# EAGLE design SparkFun Refrigerator Gas Sensor (ZMOD4450) (EAGLE 9.6.0)
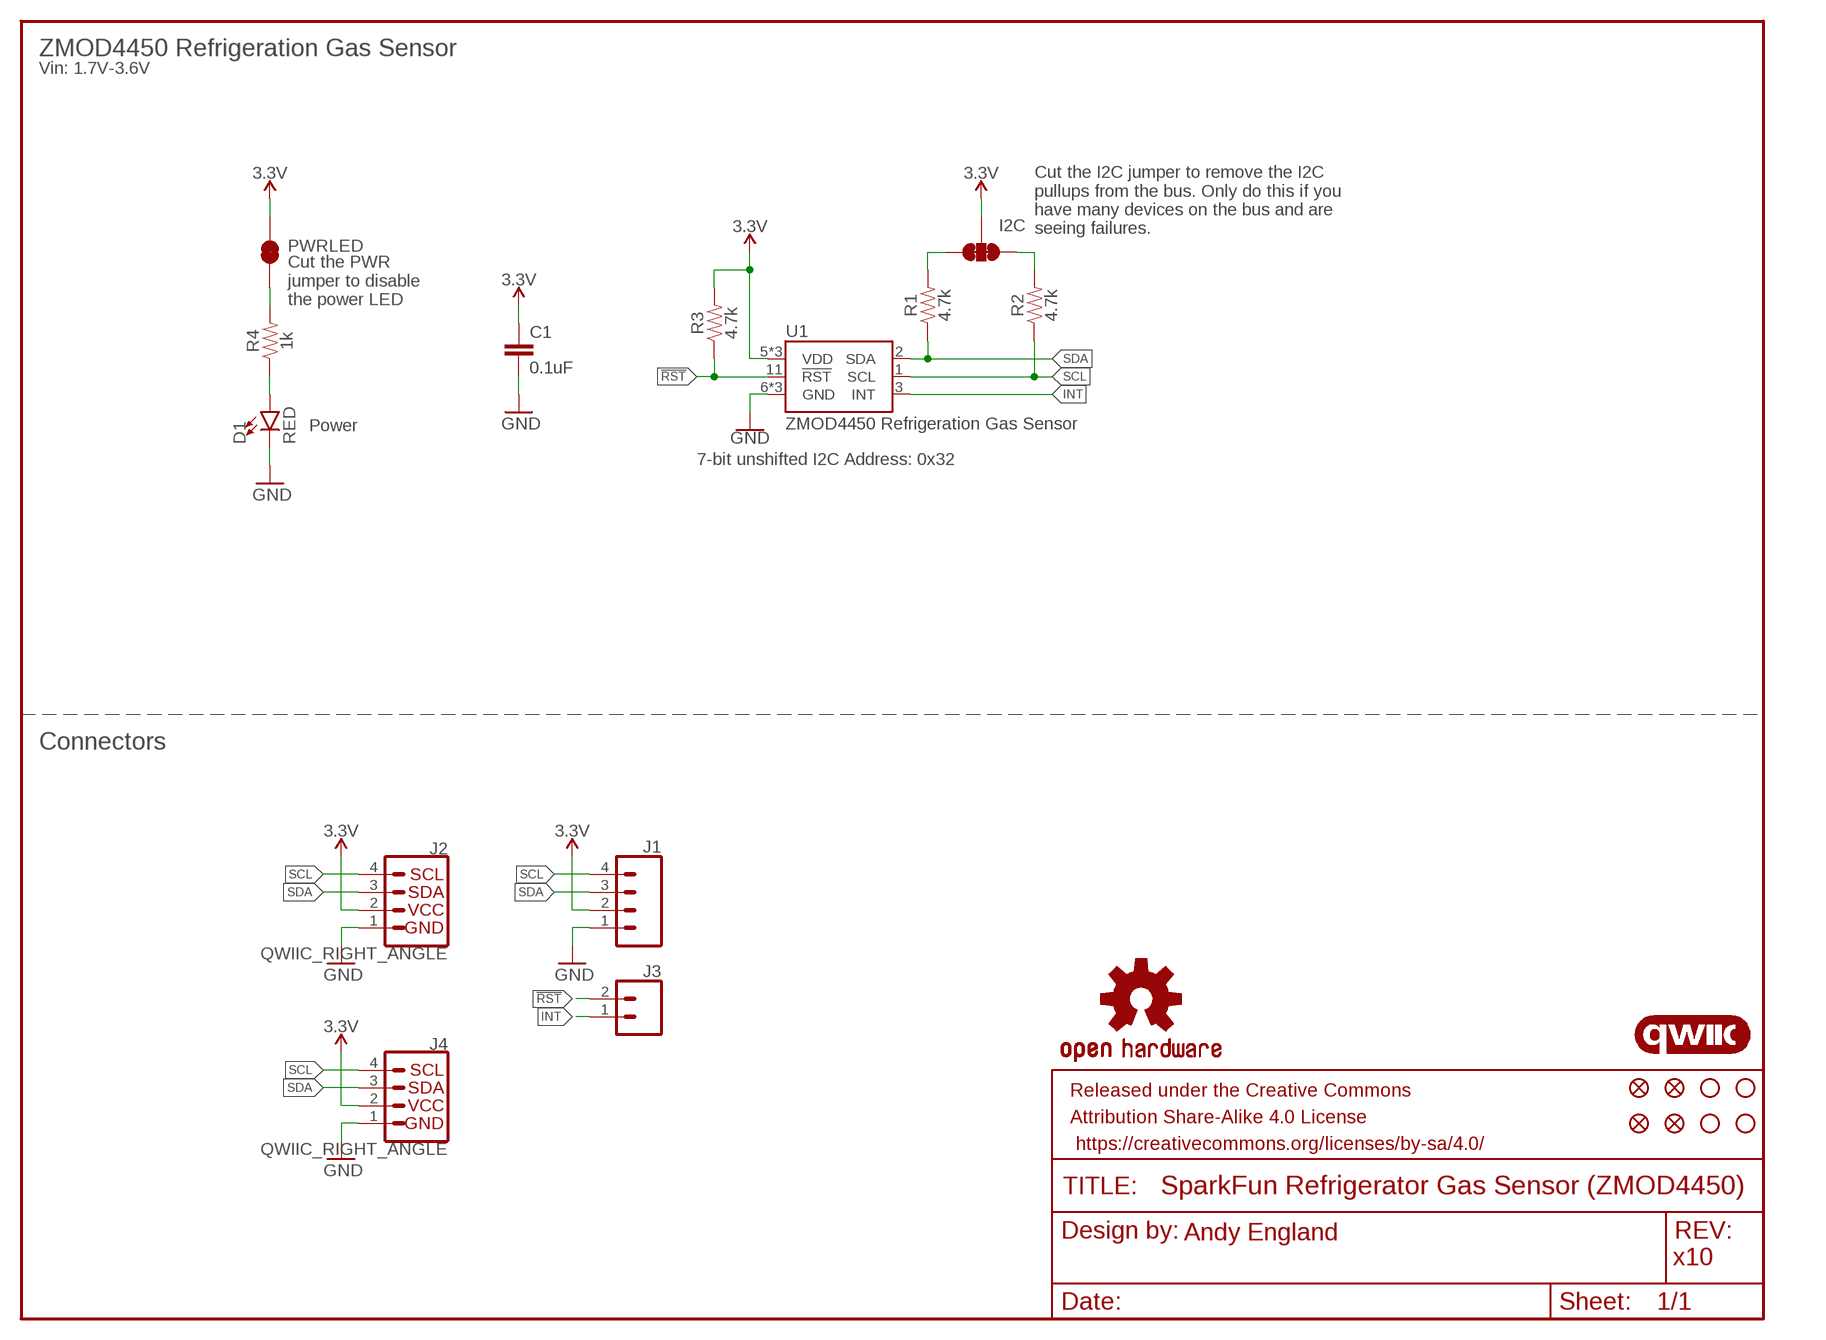
[diagram p0: schematic, sheet 1]

## Parts
C1  0.1uF  0.1UF-0603-25V-(+80/-20%)  [0603]
D1  RED  LED-RED0603  [LED-0603]
FD1  FIDUCIALUFIDUCIAL  [FIDUCIAL-MICRO]
FD2  FIDUCIALUFIDUCIAL  [FIDUCIAL-MICRO]
FD3  FIDUCIALUFIDUCIAL  [FIDUCIAL-MICRO]
FD4  FIDUCIALUFIDUCIAL  [FIDUCIAL-MICRO]
FRAME1  FRAME-LETTER  [CREATIVE_COMMONS]
H1  STAND-OFF  [STAND-OFF]
H2  STAND-OFF  [STAND-OFF]
H3  STAND-OFF  [STAND-OFF]
H4  STAND-OFF  [STAND-OFF]
I2C  JUMPER-SMT_3_2-NC_TRACE_SILK  [SMT-JUMPER_3_2-NC_TRACE_SILK]
J1  CONN_041X04_NO_SILK  [1X04_NO_SILK]
J2  QWIIC_RIGHT_ANGLE  QWIIC_CONNECTORJS-1MM  [JST04_1MM_RA]
J3  CONN_021X02_NO_SILK  [1X02_NO_SILK]
J4  QWIIC_RIGHT_ANGLE  QWIIC_CONNECTORJS-1MM  [JST04_1MM_RA]
LOGO1  OSHW-LOGOS  [OSHW-LOGO-S]
LOGO2  QWIIC_LOGO_5MM  [QWIIC_5MM]
PWRLED  JUMPER-SMT_2_NC_TRACE_SILK  [SMT-JUMPER_2_NC_TRACE_SILK]
R1  4.7k  4.7KOHM-0603-1/10W-1%  [0603]
R2  4.7k  4.7KOHM-0603-1/10W-1%  [0603]
R3  4.7k  4.7KOHM-0603-1/10W-1%  [0603]
R4  1k  1KOHM-0603-1/10W-1%  [0603]
U1  ZMOD4450 Refrigeration Gas Sensor  ZMOD4450  [LGA-12-3X3]

## Nets
3.3V: C1.1 I2C.2 J1.2 J2.2 J4.2 PWRLED.2 R3.2 U1.5(VDD) U1.10(VDD) U1.12(VDD)
!RST: J3.2 R3.1 U1.11(!RST)
GND: C1.2 D1.C J1.1 J2.1 J4.1 U1.6(GND) U1.7(GND) U1.9(GND)
INT: J3.1 U1.3(INT)
N$1: I2C.3 R1.2
N$2: D1.A R4.1
N$3: I2C.1 R2.2
N$4: PWRLED.1 R4.2
SCL: J1.4 J2.4 J4.4 R2.1 U1.1(SCL)
SDA: J1.3 J2.3 J4.3 R1.1 U1.2(SDA)

## Notes on the sheet
- ZMOD4450 Refrigeration Gas Sensor
- Vin: 1.7V-3.6V
- Cut the I2C jumper to remove the I2C
  pullups from the bus. Only do this if you
  have many devices on the bus and are
  seeing failures.
- Cut the PWR
  jumper to disable
  the power LED
- Power
- 7-bit unshifted I2C Address: 0x32
- Connectors
- Andy England
- x10

## Library data of the parts
C1 = SparkFun-Capacitors:0.1UF: 0.1µF ceramic capacitors A capacitor is a passive two-terminal electrical component used to store electrical energy temporarily in an electric field.; PROD_ID: CAP-00810
D1 = SparkFun-LED:LED-RED: Red SMD LED Used in manufacturing of most products at SparkFun Packages: 0603 - SMD 0603 package [Product Link] <http://docs.avagotech.com/docs/AV02-0551EN> 0603 SMART - SMD 0603 SMART package ( more efficient and expensive)[Product Link] <http://www.osram-os.com/Graphics/XPic2/00077099_0.pdf> 1206 - SMD1206 package [Product Link] <https://www.sparkfun.com/datasheets/DevTools/LilyPad/Q150OVS4.pdff> SparkFun Products: Pro Mini 328 -5V <https://www.sparkfun.com/products/821> RedBoard <https://www.sparkfun.com/products/12757> IOIO-OTG <https://www.sparkfun.com/products/13613>; PROD_ID: DIO-00819
FD1-FD4 = SparkFun-Aesthetics:FIDUCIAL: Fiducial Alignment Points Point-of-reference for pick-and-place machines and other optical instruments.
FRAME1 = SparkFun-Aesthetics:FRAME-LETTER: Schematic Frame - Letter Standard 8.5x11 US Letter frame
H1-H4 = SparkFun-Hardware:STAND-OFF: Stand Off Drill holes for mechanically mounting via screws, standoffs, etc. Note: Use the keepout ring to avoid running the screw head into surrounding components. Variant Overviews STAND-OFF - Mechanical footprint for a #4 phillips button head screw. STAND-OFF-TIGHT - Mechanical footprint for a #4 phillips button head screw, Example SparkFun Products Screw - Phillips Head (1/4", 4-40, 10 pack) <https://www.sparkfun.com/products/10453> (PRT-10453) Screw - Phillips Head (1/2", 4-40, 10 pack) <https://www.sparkfun.com/products/10452> (PRT-10452) Screw - Phillips Head (3/4", 4-40, 10 pack) <https://www.sparkfun.com/products/10451> (PRT-10451) Screw - Phillips Head (1", 4-40, 10 pack) <https://www.sparkfun.com/products/10450> (PRT-10450)
I2C = SparkFun-Jumpers:JUMPER-SMT_3_2-NC_TRACE: Normally closed trace jumper (2 of 2 connections) This jumper has a trace between all three pads so they are normally closed (NC). Use a razor knife to open the connection(s). For best results follow the IPC guidelines for cutting traces: Cutout at least 0.063 mm (0.005 in). Remove all loose material to clean up the cut area. Seal the cut with an approved epoxy. Reapply solder to reclose the connection(s).
J1 = SparkFun-Connectors:CONN_04: Multi connection point. Often used as Generic Header-pin footprint for 0.1 inch spaced/style header connections On any of the 0.1 inch spaced packages, you can populate with these: Break Away Headers - Straight <https://www.sparkfun.com/products/116> (PRT-00116) Break Away Male Headers - Right Angle <https://www.sparkfun.com/products/553> (PRT-00553) Female Headers <https://www.sparkfun.com/products/115> (PRT-00115) Break Away Headers - Machine Pin <https://www.sparkfun.com/products/117> (PRT-00117) Break Away Female Headers - Swiss Machine Pin <https://www.sparkfun.com/products/743> (PRT-00743) For SCREWTERMINALS and SPRING TERMINALS visit here: Screw Terimnals on SparkFun.com <https://www.sparkfun.com/search/results?term=Screw+Terminals> (5mm/3.5mm/2.54mm spacing) This device is also useful as a general connection point to wire up your design to another part of your project. Our various solder wires solder well into these plated through hole pads. Hook-Up Wire - Assortment (Stranded, 22 AWG) <https://www.sparkfun.com/products/11375> (PRT-11375) Hook-Up Wire - Assortment (Solid Core, 22 AWG) <https://www.sparkfun.com/products/11367> (PRT-11367) View the entire wire category on our website here <https://www.sparkfun.com/categories/141> Special notes: Molex polarized connector foot print use with SKU : PRT-08231 with associated crimp pins and housings. 1MM SMD Version SKU: PRT-10208; PROD_ID: CONN-09696
J2 J4 = SparkFun-Connectors:QWIIC_CONNECTOR: SparkFun I2C Standard Qwiic Connector An SMD 1mm pitch JST connector makes it easy and quick (get it? Qwiic?) to connect I2C devices to each other. The Qwiic system <http://www.sparkfun.com/qwiic> enables fast and solderless connection between popular platforms and various sensors and actuators. We carry 200mm <https://www.sparkfun.com/products/14204>, 100mm <https://www.sparkfun.com/products/14205>, 50mm <https://www.sparkfun.com/products/14206>, and breadboard friendly <https://www.sparkfun.com/products/14207> Qwiic cables. We also offer 10 pcs strips <https://www.sparkfun.com/products/14323> the SMD connectors.; PROD_ID: CONN-13694
J3 = SparkFun-Connectors:CONN_02: Multi connection point. Often used as Generic Header-pin footprint for 0.1 inch spaced/style header connections On any of the 0.1 inch spaced packages, you can populate with these: Break Away Headers - Straight <https://www.sparkfun.com/products/116> (PRT-00116) Break Away Male Headers - Right Angle <https://www.sparkfun.com/products/553> (PRT-00553) Female Headers <https://www.sparkfun.com/products/115> (PRT-00115) Break Away Headers - Machine Pin <https://www.sparkfun.com/products/117> (PRT-00117) Break Away Female Headers - Swiss Machine Pin <https://www.sparkfun.com/products/743> (PRT-00743) For SCREWTERMINALS and SPRING TERMINALS visit here: Screw Terimnals on SparkFun.com <https://www.sparkfun.com/search/results?term=Screw+Terminals> (5mm/3.5mm/2.54mm spacing) This device is also useful as a general connection point to wire up your design to another part of your project. Our various solder wires solder well into these plated through hole pads. Hook-Up Wire - Assortment (Stranded, 22 AWG) <https://www.sparkfun.com/products/11375> (PRT-11375) Hook-Up Wire - Assortment (Solid Core, 22 AWG) <https://www.sparkfun.com/products/11367> (PRT-11367) View the entire wire category on our website here <https://www.sparkfun.com/categories/141> Special notes: Molex polarized connector foot print use with: PRT-08233 with associated crimp pins and housings. 2.54_SCREWTERM for use with PRT-10571. 3.5mm Screw Terminal footprints for PRT-08084 5mm Screw Terminal footprints for use with PRT-08432
LOGO1 = SparkFun-Aesthetics:OSHW-LOGO: Open-Source Hardware (OSHW) Logo This logo indicates the piece of hardware it is found on incorporates a OSHW license and/or adheres to the definition of open source hardware found here: http://freedomdefined.org/OSHW
LOGO2 = SparkFun-Aesthetics:QWIIC_LOGO: Qwiic Logos for placement on schematic and PCB. The 5.5mm silk logo is best for placing next to Qwiic connector.
PWRLED = SparkFun-Jumpers:JUMPER-SMT_2_NC_TRACE: Normally closed trace jumper This jumper has a trace between two pads so it's normally closed (NC). Use a razor knife to open the connection. For best results follow the IPC guidelines for cutting traces: Cutout at least 0.063 mm (0.005 in). Remove all loose material to clean up the cut area. Seal the cut with an approved epoxy. Reapply solder to reclose the connection.
R1-R3 = SparkFun-Resistors:4.7KOHM: 4.7kΩ resistor A resistor is a passive two-terminal electrical component that implements electrical resistance as a circuit element. Resistors act to reduce current flow, and, at the same time, act to lower voltage levels within circuits. - Wikipedia; PROD_ID: RES-07857
R4 = SparkFun-Resistors:1KOHM: 1kΩ resistor A resistor is a passive two-terminal electrical component that implements electrical resistance as a circuit element. Resistors act to reduce current flow, and, at the same time, act to lower voltage levels within circuits. - Wikipedia; PROD_ID: RES-07856
U1 = SparkFun-Sensors:ZMOD4450: ZMOD4450 Food-Ripening Gas Sensor The ZMOD4450 gas sensor module is a software configurable platform designed for detecting gases associated with food ripening or rotting and is targeted for use in refrigeration air quality (RAQ) applications. The sensor is a 12-pin LGA assembly (3.0 x 3.0 x 0.7 mm) that consists of a gas sense element and a CMOS signal conditioning IC. The module’s sense element consists of a micro-heater and sensing material integrated on a silicon-based MEMS structure. It measures the metal oxide (MOx) conductivity, which is a function of the gas concentration. SparkFun Products: SparkFun Refrigeration Gas Sensor ZMOD4450 (Qwiic) <https://www.sparkfun.com/products/15106>; PROD_ID: IC-15106

## Board
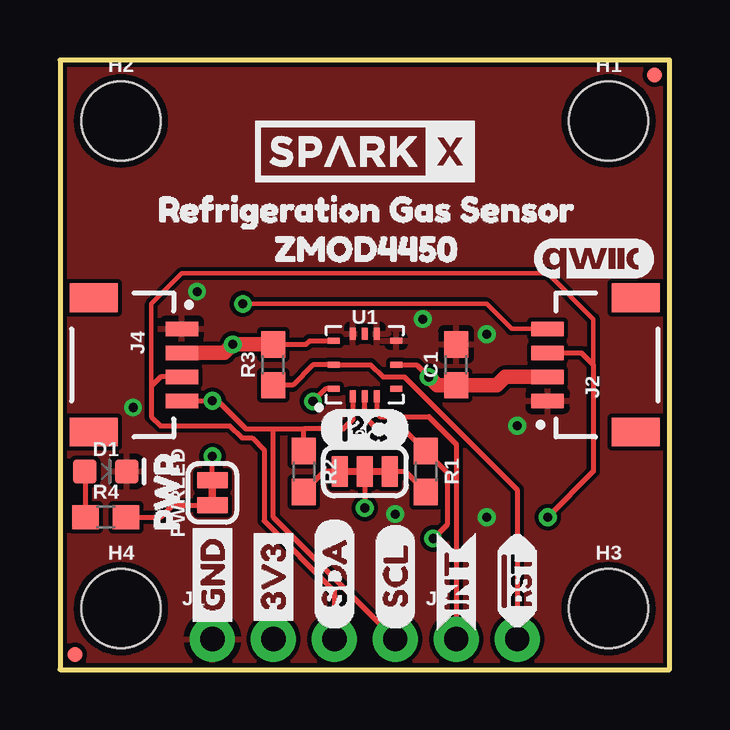
[diagram p1: board, top side]
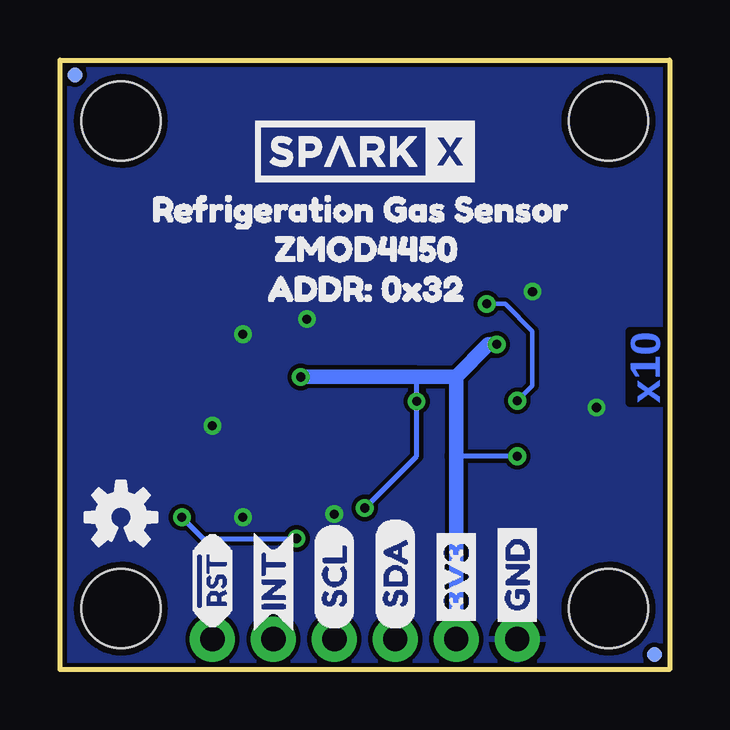
[diagram p2: board, bottom side, seen from below]

Size 25.4 x 25.4 mm. Coordinates in mm from the lower left corner, seen from the top.
Outline: 0,0 25.4,0 25.4,25.4 0,25.4 0,0
Copper layers (1*16): Top 0.035mm / dielectric 1.5mm / Bottom 0.035mm
Design rules "SparkFun-2-layer-TIGHT": minimum track width 7mil, minimum drill 15mil, track to track 7mil, track to pad 7mil, pad to pad 7mil, via to via 7mil, smd to smd 7mil, copper to edge 7mil, drill to drill 7mil, minimum pad ring 7mil, minimum via ring 7mil, stop-mask expansion 4mil, vias tented up to drill 25mil, thermal gap 10mil

### Footprints (pad centres in the part's own frame; a part is rotated, then mirrored left to right if it is on the bottom)
0603 = smd 1.1 x 1: 1 -0.85,0; 2 0.85,0
LED-0603 = smd 1 x 1: A -0.877,0; C 0.877,0
FIDUCIAL-MICRO = smd 0.635 x 0.635: 1 0,0
STAND-OFF = hole 3.302: 0,0
SMT-JUMPER_3_2-NC_TRACE_SILK = smd 0.66 x 1.27: 1 -1.041,0; 2 0,0; 3 1.041,0
1X04_NO_SILK = drill 1.016 pad 1.88: 1 0,0; 2 2.54,0; 3 5.08,0; 4 7.62,0
JST04_1MM_RA = smd 0.6 x 1.35: 1 -1.5,0; 2 -0.5,0; 3 0.5,0; 4 1.5,0 | smd 1.2 x 2: NC1 2.8,-3.675; NC2 -2.8,-3.675
1X02_NO_SILK = drill 1.016 pad 1.88: 1 0,0; 2 2.54,0
SMT-JUMPER_2_NC_TRACE_SILK = smd 0.66 x 1.27: 1 -0.521,0; 2 0.521,0
LGA-12-3X3 = smd 0.25 x 0.5: 1 -0.5,-1.3; 2 0,-1.3; 3 0.5,-1.3; 7 0.5,1.3; 8 0,1.3; 9 -0.5,1.3 | smd 0.5 x 0.25: 4 1.3,-1; 5 1.3,0; 6 1.3,1; 10 -1.3,1; 11 -1.3,0; 12 -1.3,-1

### Placement (x,y rotation side)
C1  16.51,12.7 90 top
D1  1.91,8.26 0 top
FD1  24.77,24.77 0 top
FD2  0.64,0.64 0 bottom
FD3  0.64,0.64 0 top
FD4  24.77,24.77 0 bottom
FRAME1  -10.16,-8.89 0 top  (outside the outline)
H1  22.86,22.86 0 top
H2  2.54,22.86 0 top
H3  22.86,2.54 0 top
H4  2.54,2.54 0 top
I2C  12.7,8.26 0 top
J1  6.35,1.27 0 top
J2  20.32,12.7 90 top
J3  16.51,1.27 0 top
J4  5.08,12.7 270 top
LOGO1  22.86,6.35 0 bottom
LOGO2  22.23,17.14 0 top
PWRLED  6.35,7.37 90 top
R1  15.24,8.26 270 top
R2  10.16,8.26 270 top
R3  8.89,12.7 90 top
R4  1.91,6.35 0 top
U1  12.7,12.7 0 top
U$1  [GND_P]  6.35,1.52 90 top
U$2  [GND_P]  6.35,1.52 90 bottom
U$3  [ZMOD44501]  8,17.53 0 top
U$4  [INT_O]  16.51,1.52 90 top
U$5  [3V3_P]  8.89,1.52 90 top
U$6  [3V3_P]  8.89,1.52 90 bottom
U$7  [SDA_IO]  11.43,1.65 90 top
U$8  [SDA_IO]  11.43,1.65 90 bottom
U$9  [SCL_IO]  13.97,1.65 90 top
U$10  [SCL_IO]  13.97,1.65 90 bottom
U$11  [I2C]  10.79,10.03 0 top
U$12  [PWR_TO]  4.45,4.89 90 top
U$13  [!RST_I]  19.05,1.52 90 top
U$14  [INT_O]  16.51,1.52 90 bottom
U$15  [REFRIGERATION_GAS_SENSOR0]  22.48,19.18 0 bottom
U$16  [!RST_I]  19.05,1.52 90 bottom
U$17  [REFRIGERATION_GAS_SENSOR0]  3.17,19.18 0 top
U$18  [SPARKX-MEDIUM]  12.7,21.59 0 top
U$19  [SPARKX-MEDIUM]  12.7,21.59 0 bottom
U$20  [ZMOD44501]  17.4,17.53 0 bottom
U$21  [ADDR#_0X320]  17.65,15.88 0 bottom
U$22  [PRODUCTION_INSTRUCTIONS]  -35.56,-10.16 0 top  (outside the outline)

### Tracks (layer width: path | path; a pad name or v marks a point on that pad's centre or on a via)
3.3V  (via drill 0.38)
  Top 0.203: PWRLED.2 v6.35,8.89 | R3.2 10.25,13.55 10.4,13.7 U1.10 | U1.12 11.06,11.7 v10.54,11.18 | U1.5 14.86,12.7 v15.37,12.19 | I2C.2 v12.7,6.73
  Top 0.61: J4.2 6.85,13.2 v7.2,13.55 R3.2 | J2.2 18.55,12.2 18.2,11.85 C1.1 15.71,11.85 v15.37,12.19
  Bottom 0.203: v6.35,8.89 8.89,8.89 | 10.54,12.2 v10.54,11.18 10.54,8.89 v12.7,6.73
  Bottom 0.61: v7.2,13.55 7.55,13.55 8.9,12.2 | 8.9,12.2 10.54,12.2 v15.36,12.2 v15.37,12.19 | 8.9,12.2 8.89,12.19 8.89,8.89 J1.2
!RST
  Top 0.203: R3.1 9.69,11.85 10.54,12.7 U1.11 12.95,12.7 13.46,12.19 14.35,12.19 19.05,7.49 J3.2
GND  (via drill 0.38)
  other vias: 17.78,13.97 19.05,10.16 5.71,15.75 15.11,14.61 3.05,10.92 13.97,6.48 17.78,6.35
  pour Top: 0,0 25.4,0 25.4,25.4 0,25.4
  pour Bottom: 25.4,0 0,0 0,25.4 25.4,25.4
INT
  Top 0.203: U1.3 13.2,10.68 13.34,10.54 15.37,10.54 16.51,9.4 J3.1
N$1
  Top 0.203: I2C.3 14.39,8.26 R1.2
N$2
  Top 0.203: D1.A 1.05,8.23 R4.1
N$3
  Top 0.203: I2C.1 11.01,8.26 R2.2
N$4
  Top 0.203: PWRLED.1 4.7,6.84 4.2,6.35 R4.2
SCL  (via drill 0.38)
  Top 0.178: J2.4 18.82,14.2 17.78,15.24 v7.62,15.24
  Top 0.203: U1.1 12.2,10.42 11.81,10.03 10.16,10.03 | J1.4 8.89,6.35 8.89,10.03 | R2.1 10.16,10.03 | J4.4 v6.35,11.2 6.58,11.2 7.75,10.03 8.89,10.03 | 8.89,10.03 10.16,10.03
  Bottom 0.178: v7.62,15.24 6.86,15.24 5.71,14.1 5.71,11.84 v6.35,11.2
SDA  (via drill 0.38)
  Top 0.178: 3.81,11.81 3.81,15.24 5.08,16.51 20.32,16.51 22.23,14.61 22.23,12.7
  Top 0.203: U1.2 12.7,10.54 13.21,10.03 14.31,10.03 R1.1 16.13,8.22 16.13,6.04 v15.55,5.46 | J4.3 4.2,12.2 3.81,11.81 3.81,10.54 4.19,10.16 7.08,10.16 7.59,9.65 8,9.65 8.51,9.14 8.51,6.19 11.43,3.27 J1.3 | J2.3 21.73,13.2 22.23,12.7 22.23,8.26 v20.32,6.35
  Bottom 0.203: v20.32,6.35 19.43,5.46 v15.55,5.46

### Text on the board
Bottom: x10
tDocu: Andy England | PCB's must be baked before populating